# EasyEDA Pro project pcb最终版.epro, board power
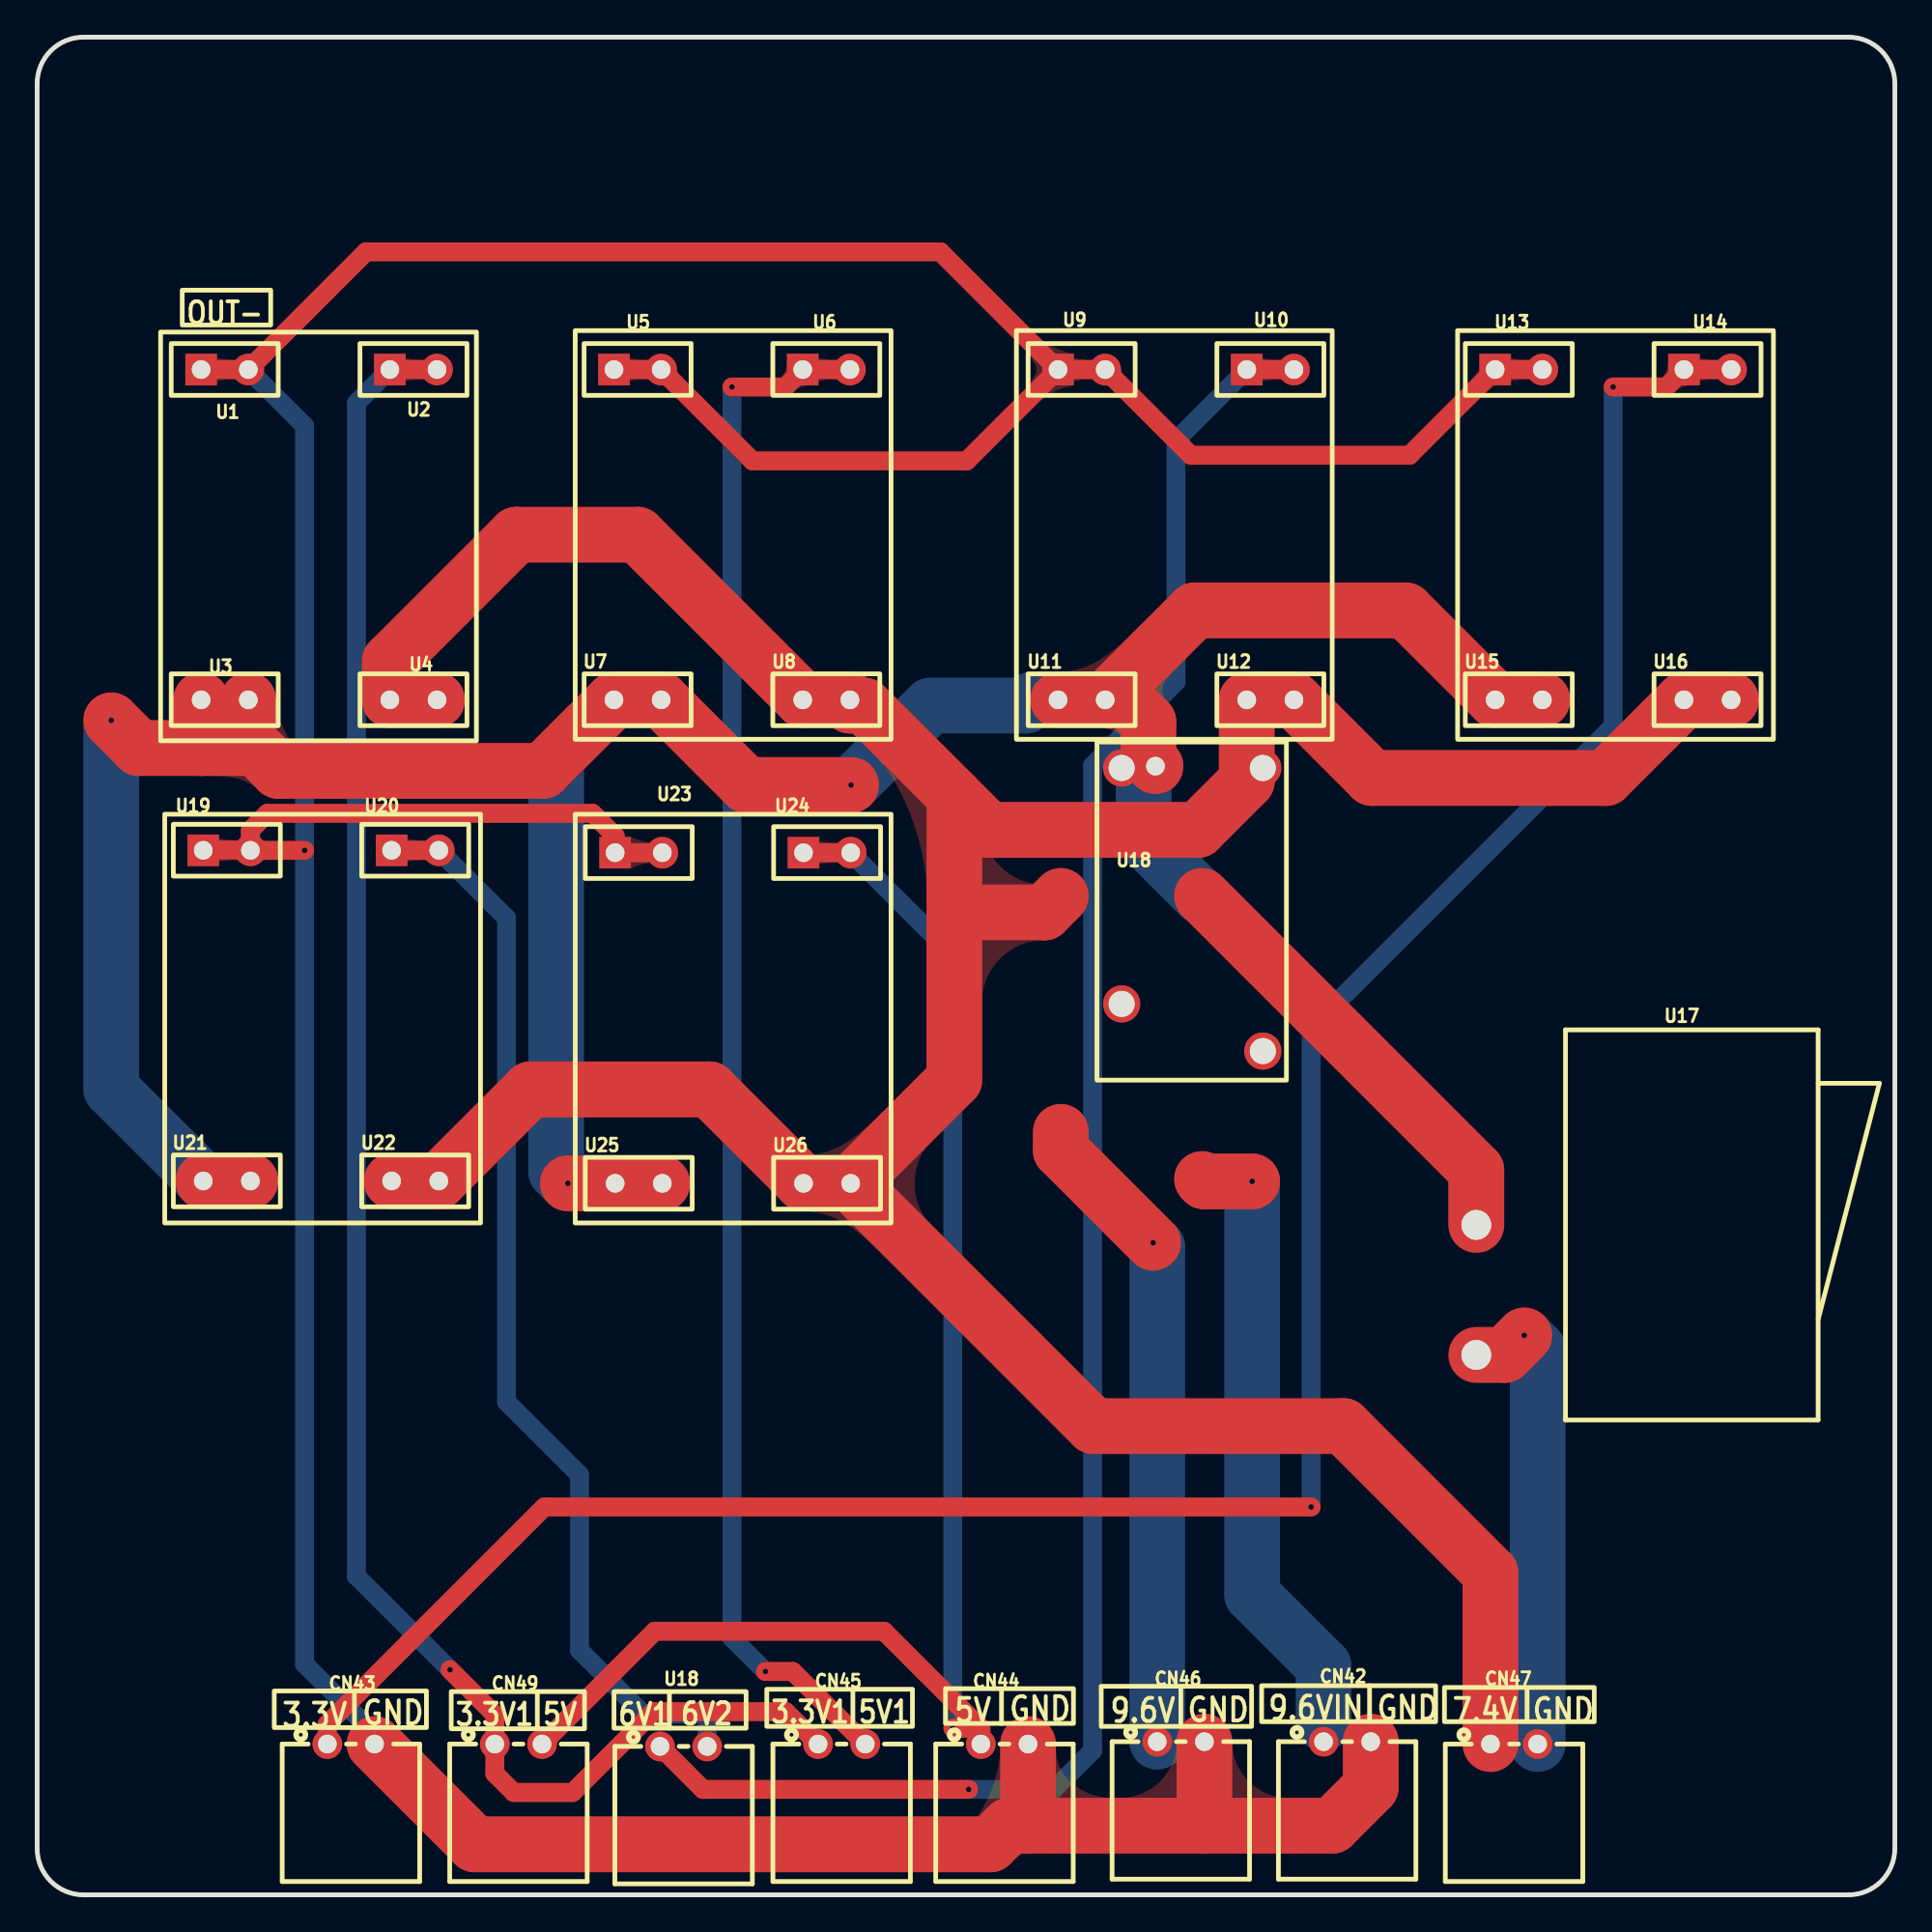
[diagram p7: board, top side]
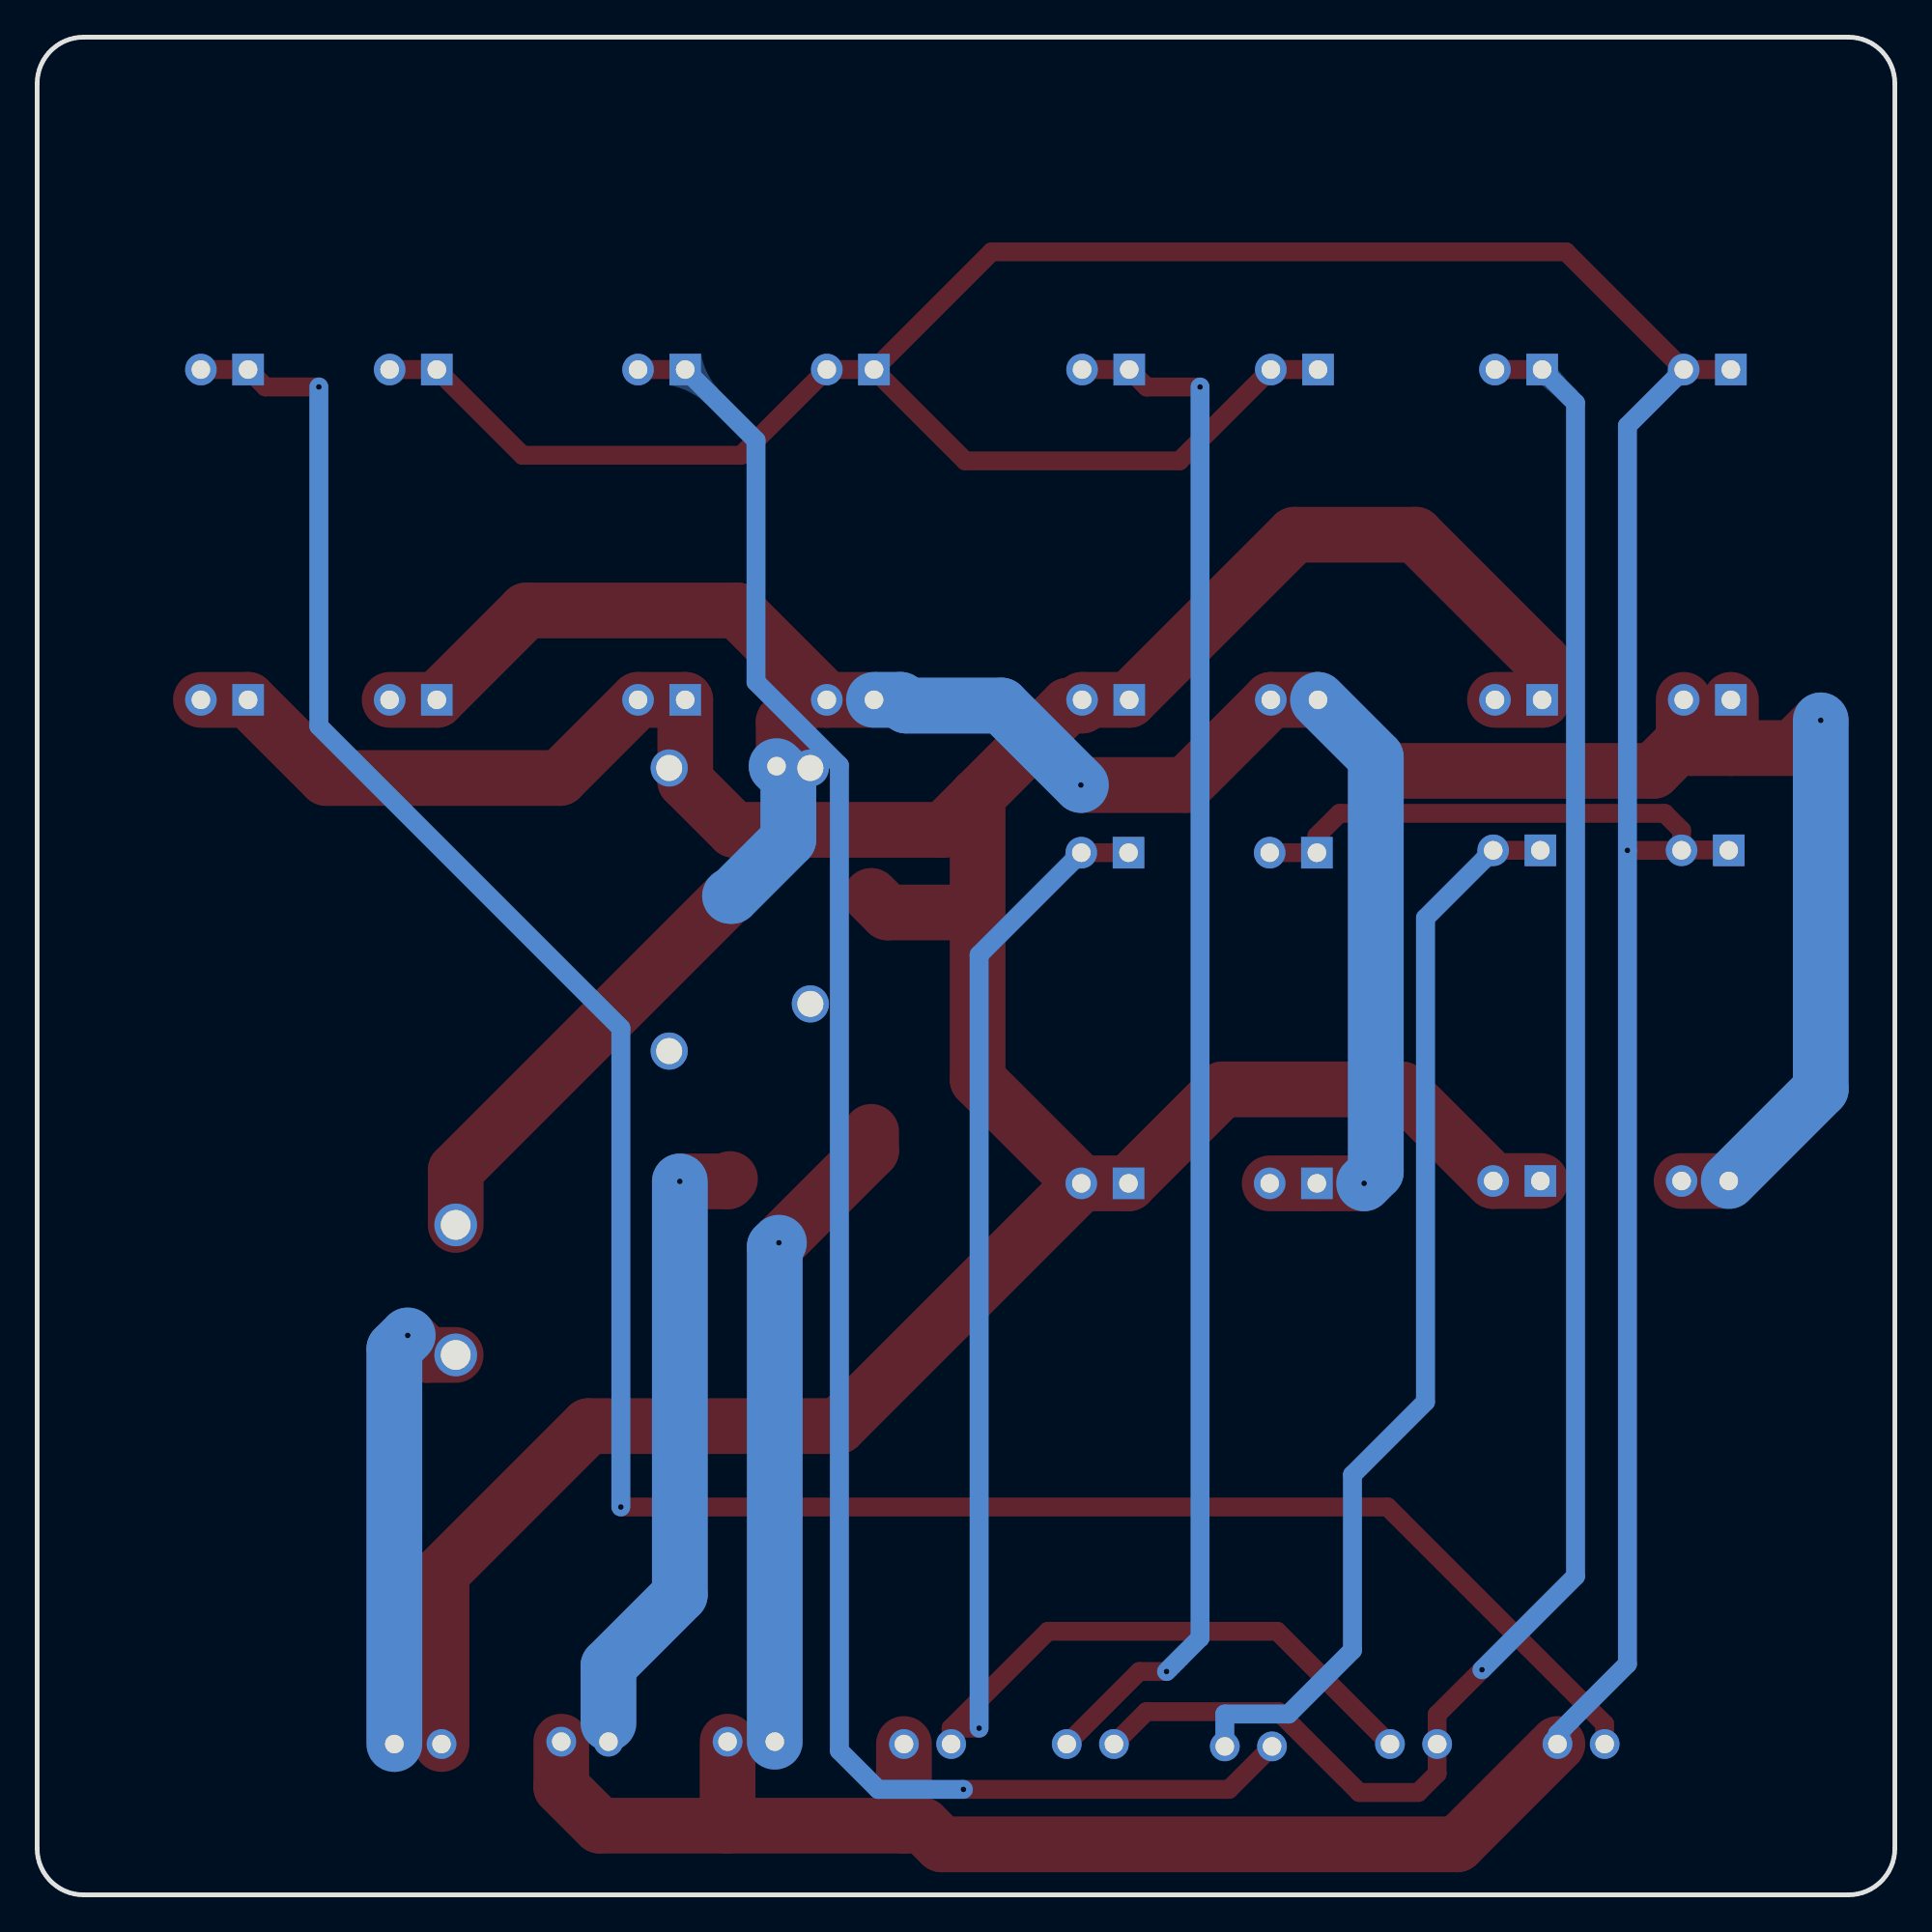
[diagram p8: board, bottom side, seen from below]

Outline 100 x 100 mm; copper layers: Top Layer, Bottom Layer. Coordinates in mm from the lower left corner of the outline.
Outline path: 0,97.5 0,2.5 arc(0.73,0.73) 2.5,0 97.5,0 arc(99.27,0.73) 100,2.5 100,97.5 arc(99.27,99.27) 97.5,100 2.5,100 arc(0.73,99.27) 0,97.5
Stack: Top Layer 0.035mm / Dielectric1 1.51mm FR4 er 4.5 / Bottom Layer 0.035mm

## Design rules (mm)
template: 我很急
spacing copperThickness1oz: track to track 0.102, other pairs 0.152 to 0.3
spacing copperThickness2oz (default): track to track 0.203, other pairs 0.203 to 0.203
spacing VCC和GND: track to track 0.762, other pairs 0.152 to 0.3
track width copperThickness1oz (default): min 0.254, default 0.254, max 1.016
track width copperThickness2oz: min 0.203, default 0.254, max 2.54
track width VCC AND GND: min 0.254, default 1.016, max 3
track width 9.6V: min 8.001, default 8.001, max 8.001
track width 7.4V: min 5.001, default 5.001, max 5.001
differential pair differentialPair (default): width min 0.127, default 0.254, max 2.54; gap min 0.152, default 0.152
via viaSize (default): diameter min 0.5, default 0.61, max 10; hole min 0.3, default 0.305, max 6.299
net 3.3V1 uses VCC AND GND
net GND uses VCC AND GND
net IN+ uses VCC AND GND
net IN- uses VCC AND GND
net 3.3V uses VCC AND GND
net 5V uses VCC AND GND
net 5V1 uses VCC AND GND
net IN-- uses VCC AND GND
net 6V1 uses VCC AND GND
net 6V2 uses VCC AND GND
net 9.6IN uses VCC AND GND
net 9.6V uses VCC AND GND

## Placement (name value [footprint] x y rotation side)
CN42  XH-2AW  [CONN-TH_XH-2AW_C2908611]  70.52 8.25 0 top
CN43  MASTER  [CONN-TH_XH-2AW_C2908611]  16.89 8.12 0 top
CN44  OPENMV  [CONN-TH_XH-2AW_C2908611]  52.07 8.12 0 top
CN45  DRIVER  [CONN-TH_XH-2AW_C2908611]  43.31 8.12 0 top
CN46  DRIVER  [CONN-TH_XH-2AW_C2908611]  61.56 8.25 0 top
CN47  XH-2AW  [CONN-TH_XH-2AW_C2908611]  79.5 8.12 0 top
CN49  MASTER  [CONN-TH_XH-2AW_C2908611]  25.91 8.12 0 top
NOREF  -  [Pad_e131]  60.2 60.76 0 top
U1  PM254-1-02-Z-8.5  [HDR-TH_2P-P2.54-V-F]  10.1 82.11 0 top
U2  PM254-1-02-Z-8.5  [HDR-TH_2P-P2.54-V-F]  20.26 82.11 0 top
U3  PM254-1-02-Z-8.5  [HDR-TH_2P-P2.54-V-F]  10.1 64.33 0 top
U4  PM254-1-02-Z-8.5  [HDR-TH_2P-P2.54-V-F]  20.26 64.33 0 top
U5  PM254-1-02-Z-8.5  [HDR-TH_2P-P2.54-V-F]  32.32 82.11 0 top
U6  PM254-1-02-Z-8.5  [HDR-TH_2P-P2.54-V-F]  42.48 82.11 0 top
U7  PM254-1-02-Z-8.5  [HDR-TH_2P-P2.54-V-F]  32.32 64.33 0 top
U8  PM254-1-02-Z-8.5  [HDR-TH_2P-P2.54-V-F]  42.48 64.33 0 top
U9  PM254-1-02-Z-8.5  [HDR-TH_2P-P2.54-V-F]  56.22 82.11 0 top
U10  PM254-1-02-Z-8.5  [HDR-TH_2P-P2.54-V-F]  66.38 82.11 0 top
U11  PM254-1-02-Z-8.5  [HDR-TH_2P-P2.54-V-F]  56.22 64.33 0 top
U12  PM254-1-02-Z-8.5  [HDR-TH_2P-P2.54-V-F]  66.38 64.33 0 top
U13  PM254-1-02-Z-8.5  [HDR-TH_2P-P2.54-V-F]  79.76 82.11 0 top
U14  PM254-1-02-Z-8.5  [HDR-TH_2P-P2.54-V-F]  89.92 82.11 0 top
U15  PM254-1-02-Z-8.5  [HDR-TH_2P-P2.54-V-F]  79.76 64.33 0 top
U16  PM254-1-02-Z-8.5  [HDR-TH_2P-P2.54-V-F]  89.92 64.33 0 top
U17  电源开关  [SW-TH_RS601A-1010013BB]  77.47 32.56 90 top
U18  SERVO  [CONN-TH_XH-2AW_C2908611]  34.8 7.99 0 top
U18#2  -  [继电器]  62.7 53.77 270 top
U19  PM254-1-02-Z-8.5  [HDR-TH_2P-P2.54-V-F]  10.21 56.23 0 top
U20  PM254-1-02-Z-8.5  [HDR-TH_2P-P2.54-V-F]  20.35 56.23 0 top
U21  PM254-1-02-Z-8.5  [HDR-TH_2P-P2.54-V-F]  10.21 38.43 0 top
U22  PM254-1-02-Z-8.5  [HDR-TH_2P-P2.54-V-F]  20.35 38.43 0 top
U23  PM254-1-02-Z-8.5  [HDR-TH_2P-P2.54-V-F]  32.38 56.1 0 top
U24  PM254-1-02-Z-8.5  [HDR-TH_2P-P2.54-V-F]  42.52 56.1 0 top
U25  PM254-1-02-Z-8.5  [HDR-TH_2P-P2.54-V-F]  32.38 38.3 0 top
U26  PM254-1-02-Z-8.5  [HDR-TH_2P-P2.54-V-F]  42.52 38.3 0 top

## Footprints (pads in the part's own frame, mm; a bottom-side part is the same pattern mirrored in y, then rotated)
CONN-TH_XH-2AW_C2908611
  round 1.6 hole 1: 1(-1.27,0) 2(1.27,0)
HDR-TH_2P-P2.54-V-F
  rect 1.7x1.7 hole 1: 1(-1.27,0)
  round 1.7 hole 1: 2(1.27,0)
Pad_e131
  round 1.6 hole 1: 1(0,0)
SW-TH_RS601A-1010013BB
  round 2.3 hole 1.6: 1(-3.5,0) 2(3.5,0)
继电器
  round 2 hole 1.4: 1(-6.888,3.275) 2(8.352,3.275) 3(5.812,-4.325) 4(-6.888,-4.325)

## Nets
3.3V: CN43.1 U14.1 U14.2
3.3V1: CN45.1 CN49.1 U2.1 U2.2
5V: CN44.1 CN49.2 U24.1 U24.2
5V1: CN45.2 U6.1 U6.2
6V1: U10.1 U10.2 U18.1
6V2: U18.2 U20.1 U20.2
9.6V: CN46.1 U18#2.3
GND: CN42.2 CN43.2 CN44.2 CN46.2 U1.1 U1.2 U5.1 U5.2 U9.1 U9.2 U13.1 U13.2 U19.1 U19.2 U23.1 U23.2
9.6IN: CN42.1 U18#2.2
IN+: CN47.1 U4.1 U4.2 U8.1 U8.2 U12.1 U12.2 U16.1 U16.2 U18#2.4 U22.1 U22.2 U26.1 U26.2
IN-: NOREF.1 U3.1 U3.2 U7.1 U7.2 U11.1 U11.2 U15.1 U15.2 U17.2 U18#2.1 U21.1 U21.2 U25.1 U25.2
IN--: CN47.2 U17.1

## Via types
v1: diameter 0.61, hole 0.305, Top Layer to Bottom Layer, 14 vias

## Routing (per net, layer and track width the routed paths; a pad name or vN(x,y) marks a point on that pad's centre or on a via; arc(x,y) is an arc through that point)
3.3V: length 132.6
  Top Layer w1.016: v1(68.58,20.88) 27.31,20.88 15.62,9.19 15.62,8.12 ; U14.2 U14.1 87.71,81.17 v1(84.84,81.17)
  Bottom Layer w1.016: v1(68.58,20.88) 68.58,46.66 84.84,62.92 v1(84.84,81.17)
3.3V1: length 102.3
  Top Layer w1.016: CN45.1 40.29,9.86 33.18,9.86 28.83,5.51 25.65,5.51 24.64,6.53 CN49.1 24.64,9.7 v1(22.22,12.12) ; U2.1 U2.2
  Bottom Layer w1.016: v1(22.22,12.12) 17.19,17.15 17.19,80.31 U2.1
5V: length 82.6
  Top Layer w1.016: v1(49.29,8.97) 50.8,8.97 ; 50.8,8.97 CN44.1 ; 50.8,8.97 45.59,14.19 33.25,14.19 CN49.2 ; U24.1 U24.2
  Bottom Layer w1.016: U24.2 49.29,50.6 v1(49.29,8.97)
5V1: length 83.6
  Top Layer w1.016: U6.2 U6.1 40.27,81.17 v1(37.4,81.17) ; CN45.2 40.67,12.02 v1(39.2,12.02)
  Bottom Layer w1.016: v1(39.2,12.02) 37.4,13.83 v1(37.4,81.17)
6V1: length 105.4
  Top Layer w1.016: v1(50.14,5.68) 35.84,5.68 U18.1 ; U10.1 U10.2
  Bottom Layer w1.016: U10.1 61.3,78.3 61.3,65.29 56.81,60.8 56.81,7.76 54.73,5.68 v1(50.14,5.68)
6V2: length 58.8
  Top Layer w1.016: U20.1 U20.2
  Bottom Layer w1.016: U20.2 25.27,52.58 25.27,26.54 29.2,22.61 29.2,13.17 32.63,9.73 36.07,9.73 U18.2
9.6V: length 35
  Top Layer w3: v1(60.07,35.1) 55.1,40.07 55.1,41.07
  Bottom Layer w3: CN46.1 60.29,34.88 v1(60.07,35.1)
GND: length 285.1
  Top Layer w1.016: U9.1 50.04,77.19 38.51,77.19 U5.2 U5.1 ; U9.1 48.62,88.44 17.7,88.44 U1.2 U1.1 ; U9.1 U9.2 62.11,77.49 73.87,77.49 U13.1 U13.2 ; U19.2 11.48,56.22 v1(14.39,56.22) ; U19.2 11.46,56.25 8.96,56.25 U19.1 ; U19.2 11.48,57.31 12.39,58.22 29.9,58.22 31.11,57 U23.1 33.65,56.1
  Top Layer w3: 62.83,3.73 CN46.2 ; 62.83,3.73 69.71,3.73 71.79,5.8 CN42.2 ; 62.83,3.73 53.34,3.73 ; 53.34,3.73 CN44.2 ; 53.34,3.73 52.32,3.73 51.31,2.72 23.56,2.72 CN43.2
  Bottom Layer w1.016: U1.2 14.39,79.08 v1(14.39,56.22) 14.39,12.43 18.16,8.66 CN43.2
9.6IN: length 33.5
  Top Layer w3: v1(65.41,38.41) 62.83,38.41 62.7,38.53
  Bottom Layer w3: 69.25,9.25 69.25,12.32 65.41,16.16 v1(65.41,38.41)
IN+: length 205.5
  Top Layer w3: 49.37,59.16 51.21,57.33 62.48,57.33 65.11,59.96 U12.1 U12.2 71.86,60.12 84.44,60.12 U16.1 U16.2 ; 49.37,59.16 49.37,43.88 U26.2 ; 49.37,59.16 44.52,64.02 43.75,64.02 U8.2 U8.1 32.32,73.21 25.79,73.21 18.99,66.41 U4.1 U4.2 ; U26.2 56.86,25.23 70.32,25.23 78.23,17.32 CN47.1 ; U26.2 U26.1 36.19,43.36 26.55,43.36 U22.2 U22.1 ; 55.1,53.77 54.22,52.88 49.66,52.88
IN-: length 192.5
  Top Layer w3: v1(28.57,38.3) U25.1 33.65,38.3 ; 8.83,61.73 10.97,61.73 11.37,62.13 ; 8.83,61.73 U3.1 ; 8.83,61.73 5.48,61.73 v1(3.99,63.22) ; 11.37,62.13 12.99,60.5 27.23,60.5 U7.1 U7.2 38.18,59.74 v1(43.81,59.74) ; 11.37,62.13 U3.2 ; U21.1 U21.2 ; 62.7,53.77 77.47,39.01 U17.2 ; U11.2 58.63,64.33 59.82,63.14 59.82,61.14 NOREF.1 ; U11.2 62.31,69.14 73.67,69.14 U15.1 U15.2 ; U11.2 U11.1
  Bottom Layer w3: U11.1 53.52,64.33 53.21,64.02 48.09,64.02 v1(43.81,59.74) ; 62.7,53.77 62.61,53.77 59.56,56.82 59.56,60.12 NOREF.1 ; U7.1 27.94,61.22 27.94,38.93 v1(28.57,38.3) ; U21.1 3.99,43.38 v1(3.99,63.22)
IN--: length 25.3
  Top Layer w3: v1(80.05,30.11) 79,29.06 U17.1
  Bottom Layer w3: CN47.2 80.77,29.39 v1(80.05,30.11)

## Copper pours and planes (outline as drawn; the poured copper is in the pictures)
(no net) on Top Layer: 0.25,100.38 102.11,100.38 102.11,-0.97 0.25,-0.97
(no net) on Top Layer: 0,100.13 101.35,100.13 101.35,-0.58 0,-0.58

Small or netless copper shapes (teardrops, artwork), in the pictures only: 68 on Top Layer, 8 on Bottom Layer

## Text on the board
Top Silkscreen Layer: OUT- | 3.3V1 | 5V | 6V1 | 6V2 | 5V1 | 3.3V | GND | 9.6V | 9.6VIN | 7.4V
